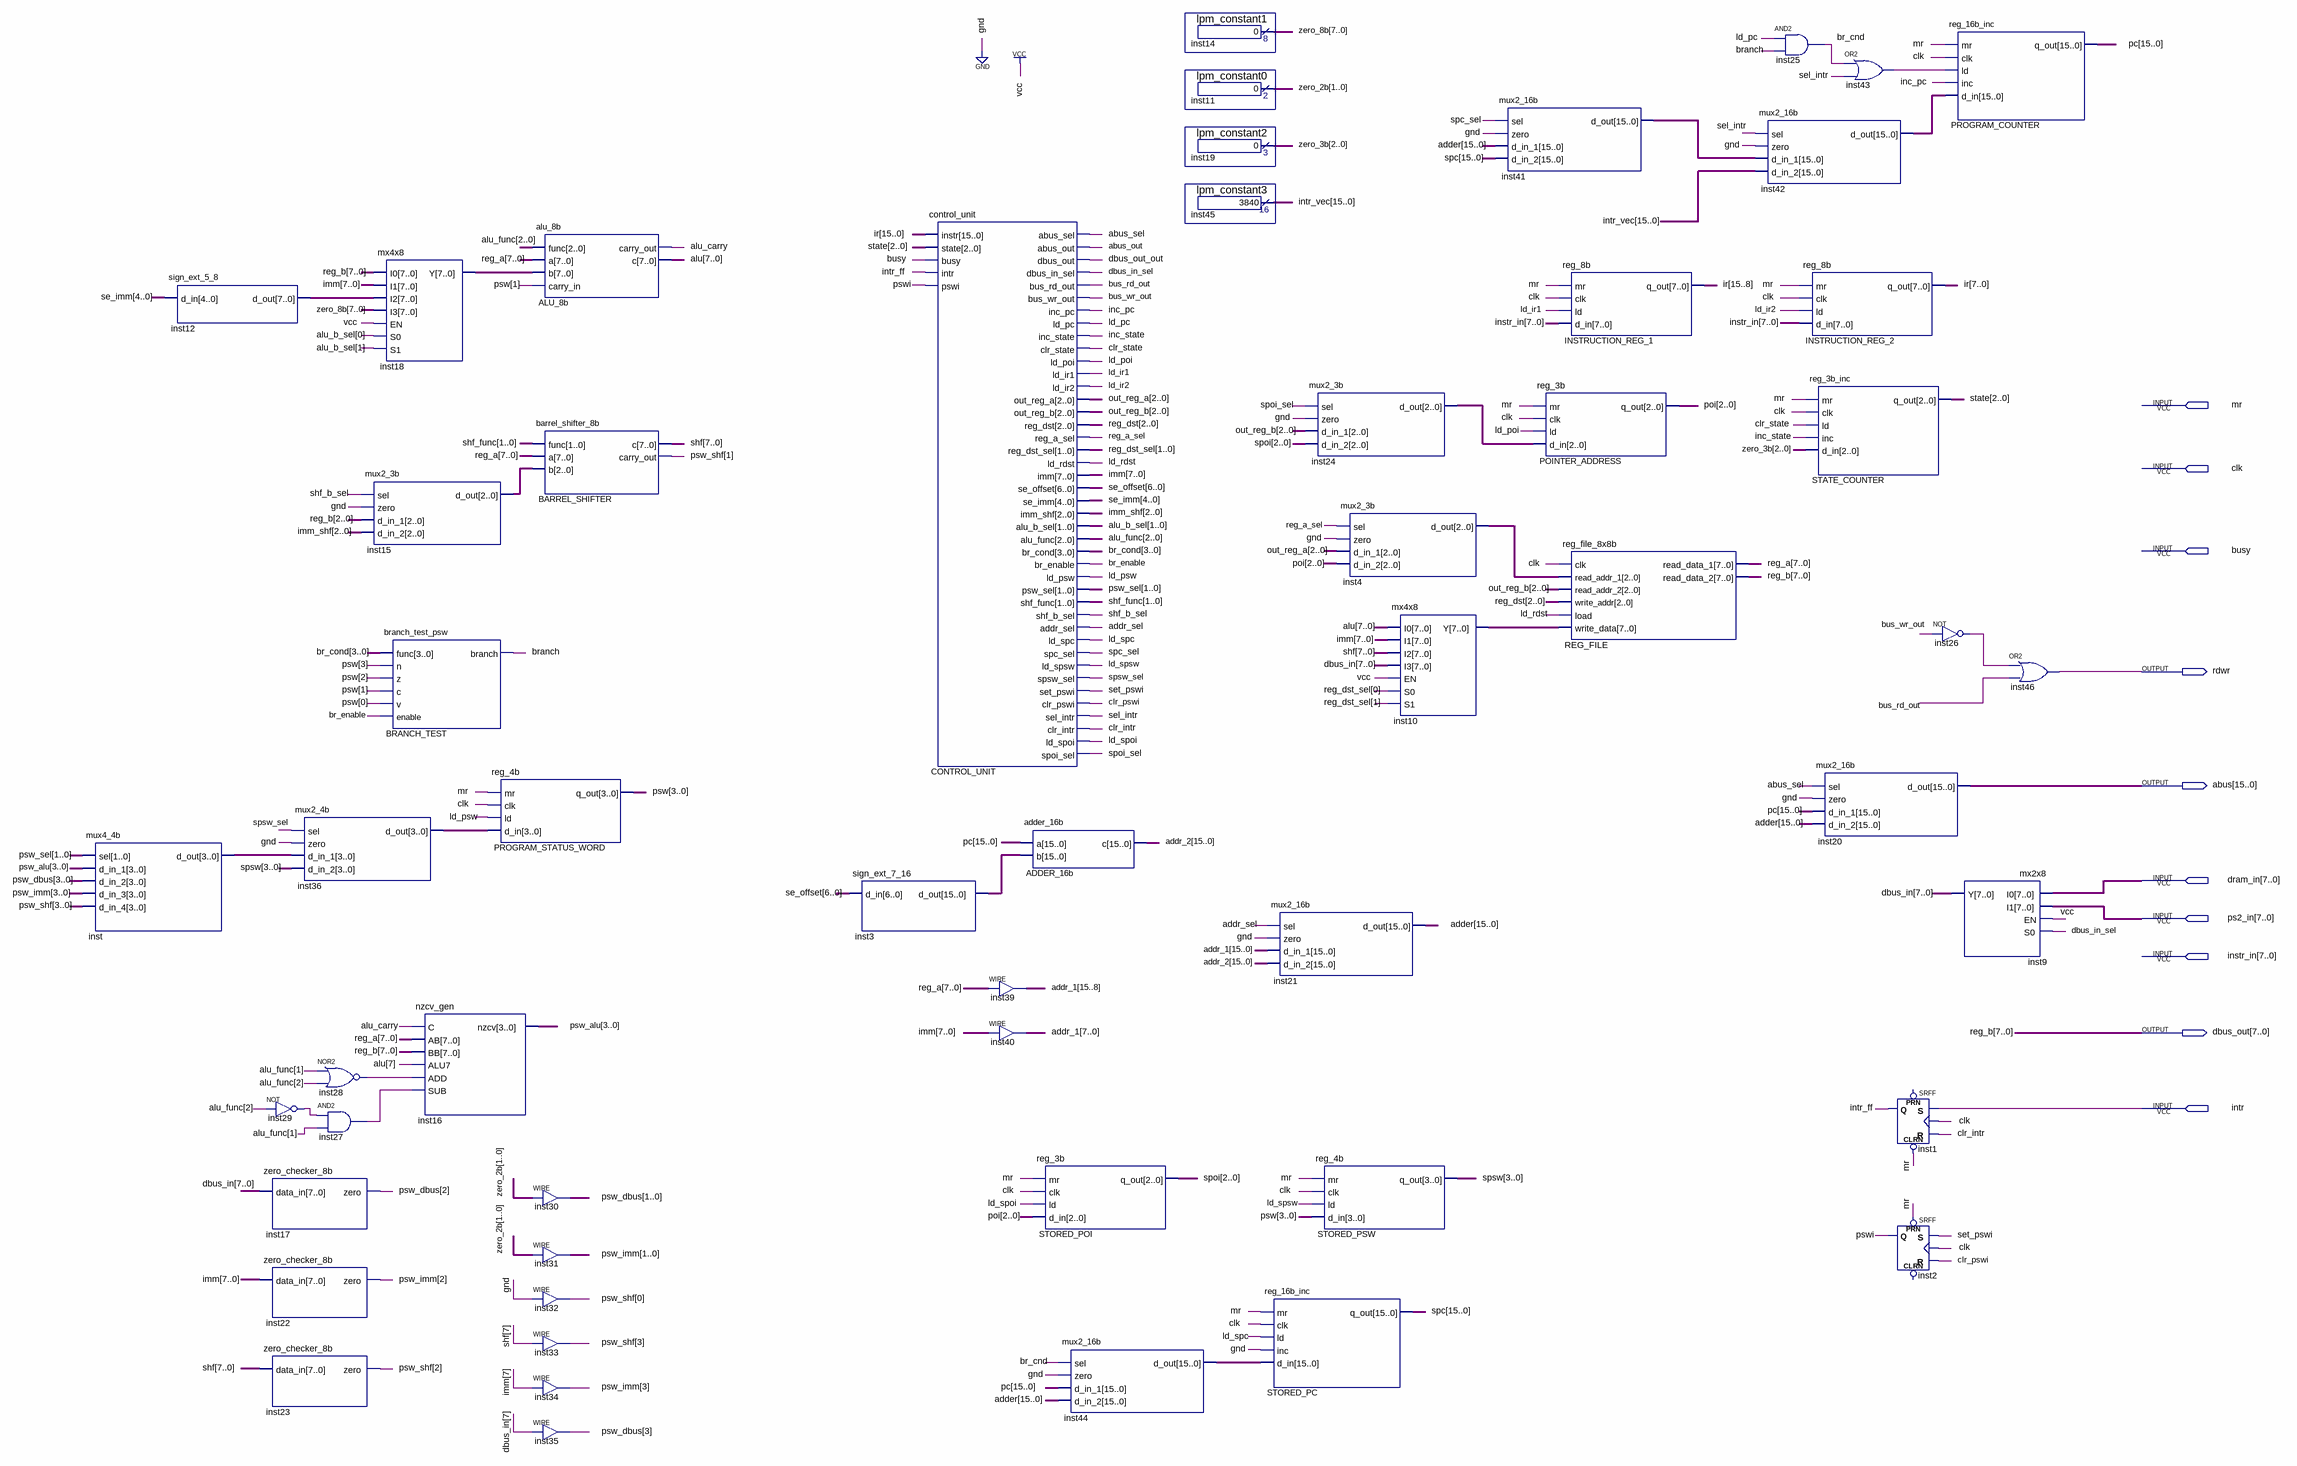
[diagram p0: schematic sheet]
// Quartus schematic CPU.bdf as structural Verilog: 55 symbols, 10 pins
module CPU (
  input  mr,
  input  clk,
  input  busy,
  input  [7:0] dram_in,
  input  [7:0] ps2_in,
  input  [7:0] instr_in,
  input  intr,
  output rdwr,
  output [15:0] abus,
  output [7:0] dbus_out
);

  wire abus_out, abus_sel, addr_sel, alu_carry, br_cnd, br_enable, branch, bus_rd_out, bus_wr_out, clr_intr,
       clr_pswi, clr_state, dbus_in_sel, dbus_out_out, inc_pc, inc_state, inst26_out, inst27_out, inst28_out,
       inst29_out, inst43_out, intr_ff, ld_ir1, ld_ir2, ld_pc, ld_poi, ld_psw, ld_rdst, ld_spc, ld_spoi,
       ld_spsw, pswi, reg_a_sel, sel_intr, set_pswi, shf_b_sel, spc_sel, spoi_sel, spsw_sel;
  wire [1:0] alu_b_sel, psw_sel, reg_dst_sel, shf_func, zero_2b;
  wire [2:0] alu_func, imm_shf, inst4_d_out, inst15_d_out, inst24_d_out, out_reg_a, out_reg_b, poi, reg_dst,
       spoi, state, zero_3b;
  wire [3:0] br_cond, inst36_d_out, inst_d_out, psw, psw_alu, psw_dbus, psw_imm, psw_shf, spsw;
  wire [4:0] se_imm;
  wire [6:0] se_offset;
  wire [7:0] alu, dbus_in, imm, inst10_y, inst12_d_out, inst18_y, reg_a, shf, zero_8b;
  wire [15:0] adder, addr_1, addr_2, inst3_d_out, inst41_d_out, inst42_d_out, inst44_d_out, intr_vec, ir, pc,
       spc;

  mux4_4b inst (
    .sel(psw_sel), .d_in_1(psw_alu), .d_in_2(psw_dbus), .d_in_3(psw_imm), .d_in_4(psw_shf), .d_out(inst_d_out));
  sign_ext_5_8 inst12 (.d_in(se_imm), .d_out(inst12_d_out));
  not inst29 (inst29_out, alu_func[2]);
  zero_checker_8b inst17 (.data_in(dbus_in), .zero(psw_dbus[2]));
  zero_checker_8b inst22 (.data_in(imm), .zero(psw_imm[2]));
  zero_checker_8b inst23 (.data_in(shf), .zero(psw_shf[2]));
  mux2_4b inst36 (.sel(spsw_sel), .zero(1'b0), .d_in_1(inst_d_out), .d_in_2(spsw), .d_out(inst36_d_out));
  nor inst28 (inst28_out, alu_func[1], alu_func[2]);
  and inst27 (inst27_out, inst29_out, alu_func[1]);
  mx4x8 inst18 (
    .I0(dbus_out), .I1(imm), .I2(inst12_d_out), .I3(zero_8b), .EN(1'b1), .S0(alu_b_sel[0]),
    .S1(alu_b_sel[1]), .Y(inst18_y));
  mux2_3b inst15 (.sel(shf_b_sel), .zero(1'b0), .d_in_1(dbus_out[2:0]), .d_in_2(imm_shf), .d_out(inst15_d_out));
  branch_test_psw BRANCH_TEST (
    .func(br_cond), .n(psw[3]), .z(psw[2]), .c(psw[1]), .v(psw[0]), .enable(br_enable), .branch(branch));
  nzcv_gen inst16 (
    .C(alu_carry), .AB(reg_a), .BB(dbus_out), .ALU7(alu[7]), .ADD(inst28_out), .SUB(inst27_out),
    .nzcv(psw_alu));
  reg_4b PROGRAM_STATUS_WORD (.mr(mr), .clk(clk), .ld(ld_psw), .d_in(inst36_d_out), .q_out(psw));
  alu_8b ALU_8b (.func(alu_func), .a(reg_a), .b(inst18_y), .carry_in(psw[1]), .carry_out(alu_carry), .c(alu));
  barrel_shifter_8b BARREL_SHIFTER (.func(shf_func), .a(reg_a), .b(inst15_d_out), .c(shf), .carry_out(psw_shf[1]));
  assign psw_dbus[1:0] = zero_2b;  // WIRE inst30
  assign psw_imm[1:0] = zero_2b;  // WIRE inst31
  assign psw_shf[0] = 1'b0;  // WIRE inst32
  assign psw_shf[3] = shf[7];  // WIRE inst33
  assign psw_imm[3] = imm[7];  // WIRE inst34
  assign psw_dbus[3] = dbus_in[7];  // WIRE inst35
  sign_ext_7_16 inst3 (.d_in(se_offset), .d_out(inst3_d_out));
  control_unit CONTROL_UNIT (
    .instr(ir), .state(state), .busy(busy), .intr(intr_ff), .pswi(pswi), .abus_sel(abus_sel),
    .abus_out(abus_out), .dbus_out(dbus_out_out), .dbus_in_sel(dbus_in_sel), .bus_rd_out(bus_rd_out),
    .bus_wr_out(bus_wr_out), .inc_pc(inc_pc), .ld_pc(ld_pc), .inc_state(inc_state), .clr_state(clr_state),
    .ld_poi(ld_poi), .ld_ir1(ld_ir1), .ld_ir2(ld_ir2), .out_reg_a(out_reg_a), .out_reg_b(out_reg_b),
    .reg_dst(reg_dst), .reg_a_sel(reg_a_sel), .reg_dst_sel(reg_dst_sel), .ld_rdst(ld_rdst), .imm(imm),
    .se_offset(se_offset), .se_imm(se_imm), .imm_shf(imm_shf), .alu_b_sel(alu_b_sel), .alu_func(alu_func),
    .br_cond(br_cond), .br_enable(br_enable), .ld_psw(ld_psw), .psw_sel(psw_sel), .shf_func(shf_func),
    .shf_b_sel(shf_b_sel), .addr_sel(addr_sel), .ld_spc(ld_spc), .spc_sel(spc_sel), .ld_spsw(ld_spsw),
    .spsw_sel(spsw_sel), .set_pswi(set_pswi), .clr_pswi(clr_pswi), .sel_intr(sel_intr), .clr_intr(clr_intr),
    .ld_spoi(ld_spoi), .spoi_sel(spoi_sel));
  assign addr_1[15:8] = reg_a;  // WIRE inst39
  assign addr_1[7:0] = imm;  // WIRE inst40
  adder_16b ADDER_16b (.a(pc), .b(inst3_d_out), .c(addr_2));
  reg_3b STORED_POI (.mr(mr), .clk(clk), .ld(ld_spoi), .d_in(poi), .q_out(spoi));
  mux2_16b inst44 (.sel(br_cnd), .zero(1'b0), .d_in_1(pc), .d_in_2(adder), .d_out(inst44_d_out));
  lpm_constant1 inst14 (.result(zero_8b));
  lpm_constant0 inst11 (.result(zero_2b));
  lpm_constant2 inst19 (.result(zero_3b));
  lpm_constant3 inst45 (.result(intr_vec));
  mux2_16b inst21 (.sel(addr_sel), .zero(1'b0), .d_in_1(addr_1), .d_in_2(addr_2), .d_out(adder));
  reg_16b_inc STORED_PC (.mr(mr), .clk(clk), .ld(ld_spc), .inc(1'b0), .d_in(inst44_d_out), .q_out(spc));
  mux2_3b inst24 (.sel(spoi_sel), .zero(1'b0), .d_in_1(out_reg_b), .d_in_2(spoi), .d_out(inst24_d_out));
  mux2_3b inst4 (.sel(reg_a_sel), .zero(1'b0), .d_in_1(out_reg_a), .d_in_2(poi), .d_out(inst4_d_out));
  reg_4b STORED_PSW (.mr(mr), .clk(clk), .ld(ld_spsw), .d_in(psw), .q_out(spsw));
  mx4x8 inst10 (
    .I0(alu), .I1(imm), .I2(shf), .I3(dbus_in), .EN(1'b1), .S0(reg_dst_sel[0]), .S1(reg_dst_sel[1]),
    .Y(inst10_y));
  mux2_16b inst41 (.sel(spc_sel), .zero(1'b0), .d_in_1(adder), .d_in_2(spc), .d_out(inst41_d_out));
  reg_3b POINTER_ADDRESS (.mr(mr), .clk(clk), .ld(ld_poi), .d_in(inst24_d_out), .q_out(poi));
  reg_8b INSTRUCTION_REG_1 (.mr(mr), .clk(clk), .ld(ld_ir1), .d_in(instr_in), .q_out(ir[15:8]));
  reg_file_8x8b REG_FILE (
    .clk(clk), .read_addr_1(inst4_d_out), .read_addr_2(out_reg_b), .write_addr(reg_dst), .load(ld_rdst),
    .write_data(inst10_y), .read_data_1(reg_a), .read_data_2(dbus_out));
  mux2_16b inst42 (.sel(sel_intr), .zero(1'b0), .d_in_1(inst41_d_out), .d_in_2(intr_vec), .d_out(inst42_d_out));
  and inst25 (br_cnd, ld_pc, branch);
  reg_8b INSTRUCTION_REG_2 (.mr(mr), .clk(clk), .ld(ld_ir2), .d_in(instr_in), .q_out(ir[7:0]));
  reg_3b_inc STATE_COUNTER (.mr(mr), .clk(clk), .ld(clr_state), .inc(inc_state), .d_in(zero_3b), .q_out(state));
  or inst43 (inst43_out, br_cnd, sel_intr);
  mux2_16b inst20 (.sel(abus_sel), .zero(1'b0), .d_in_1(pc), .d_in_2(adder), .d_out(abus));
  SRFF inst1 (.CLRN(mr), .S(intr), .R(clr_intr), .CLK(clk), .Q(intr_ff));  // open: PRN
  SRFF inst2 (.PRN(mr), .S(set_pswi), .R(clr_pswi), .CLK(clk), .Q(pswi));  // open: CLRN
  reg_16b_inc PROGRAM_COUNTER (.mr(mr), .clk(clk), .ld(inst43_out), .inc(inc_pc), .d_in(inst42_d_out), .q_out(pc));
  not inst26 (inst26_out, bus_wr_out);
  mx2x8 inst9 (.I0(dram_in), .I1(ps2_in), .EN(1'b1), .S0(dbus_in_sel), .Y(dbus_in));
  or inst46 (rdwr, inst26_out, bus_rd_out);

  // Other names for the same wires on the sheet: reg_b[7:0] = dbus_out
endmodule
